# EAGLE design exp30ac (EAGLE 7.7.0)
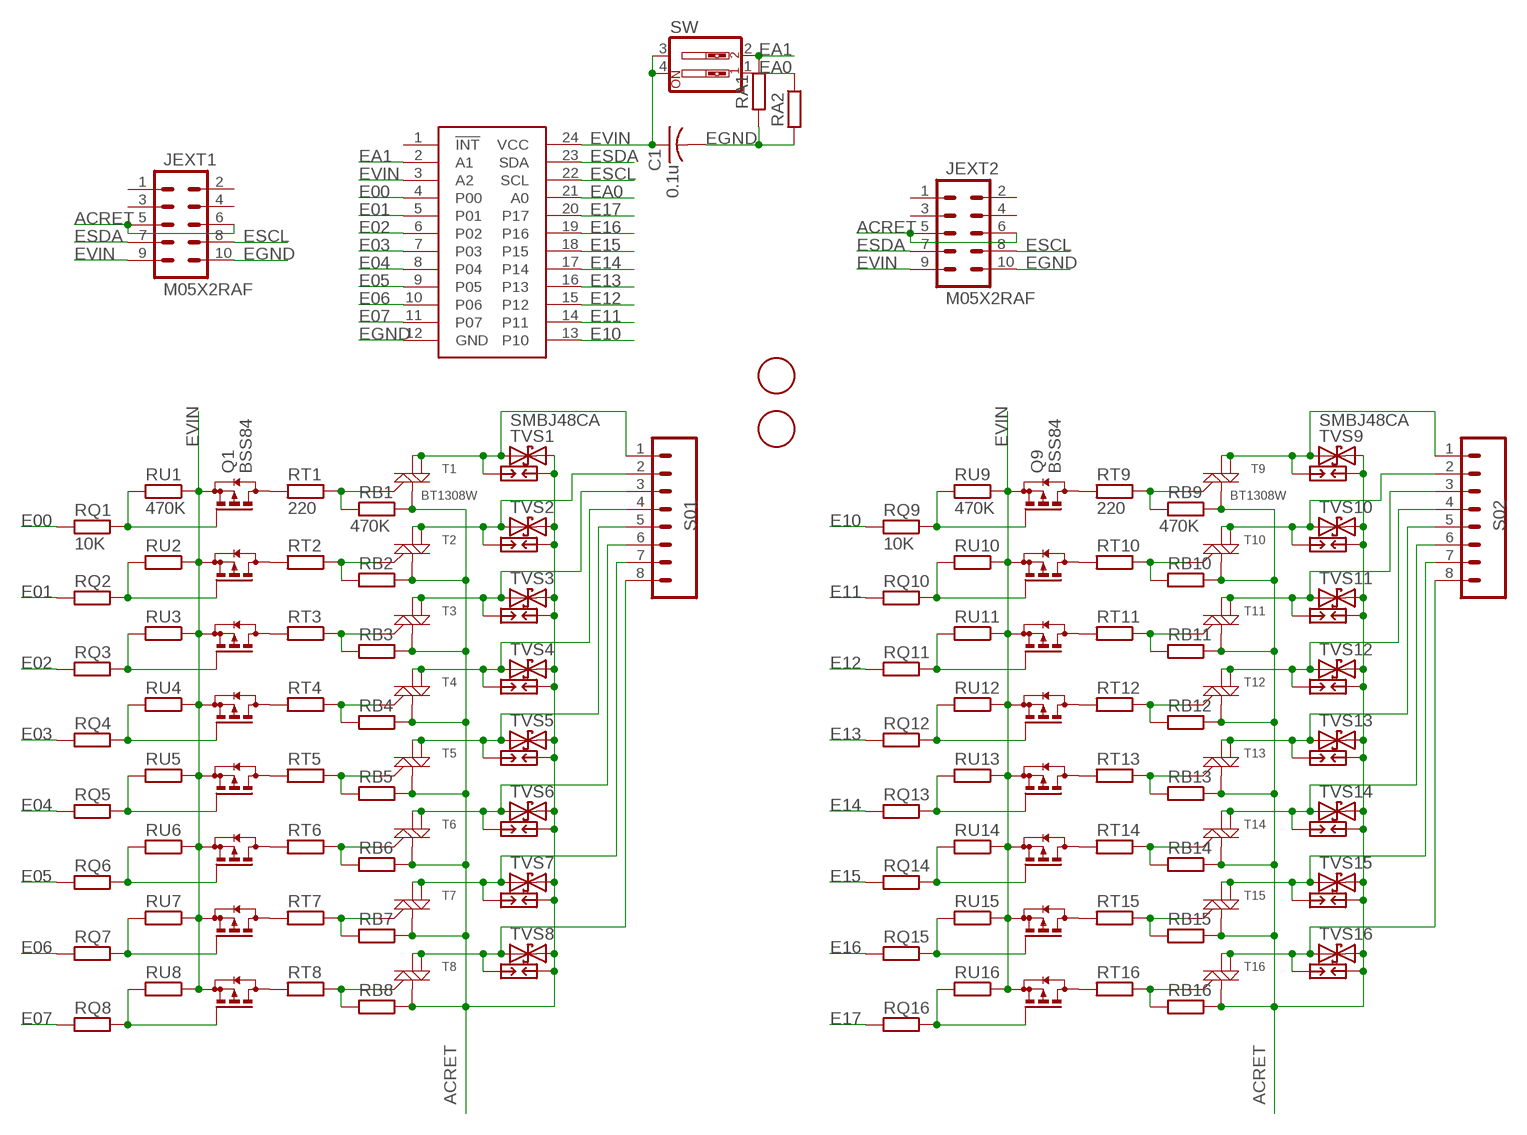
[diagram p0: schematic, sheet 1]

## Parts
C1  0.1u  C-USC0603  [C0603]
JEXT1  M05X2RAF  [2X5-RAF]
JEXT2  M05X2RAF  [2X5-RAF]
PCF8575  PCF8575  [SSOP24]
Q1  BSS84  [SOT23]
Q2  BSS84  [SOT23]
Q3  BSS84  [SOT23]
Q4  BSS84  [SOT23]
Q5  BSS84  [SOT23]
Q6  BSS84  [SOT23]
Q7  BSS84  [SOT23]
Q8  BSS84  [SOT23]
Q9  BSS84  [SOT23]
Q10  BSS84  [SOT23]
Q11  BSS84  [SOT23]
Q12  BSS84  [SOT23]
Q13  BSS84  [SOT23]
Q14  BSS84  [SOT23]
Q15  BSS84  [SOT23]
Q16  BSS84  [SOT23]
RA1  10K  R-EU_R0603  [R0603]
RA2  10K  R-EU_R0603  [R0603]
RB1  470K  R-EU_R0603  [R0603]
RB2  470K  R-EU_R0603  [R0603]
RB3  470K  R-EU_R0603  [R0603]
RB4  470K  R-EU_R0603  [R0603]
RB5  470K  R-EU_R0603  [R0603]
RB6  470K  R-EU_R0603  [R0603]
RB7  470K  R-EU_R0603  [R0603]
RB8  470K  R-EU_R0603  [R0603]
RB9  470K  R-EU_R0603  [R0603]
RB10  470K  R-EU_R0603  [R0603]
RB11  470K  R-EU_R0603  [R0603]
RB12  470K  R-EU_R0603  [R0603]
RB13  470K  R-EU_R0603  [R0603]
RB14  470K  R-EU_R0603  [R0603]
RB15  470K  R-EU_R0603  [R0603]
RB16  470K  R-EU_R0603  [R0603]
RQ1  10K  R-EU_R0603  [R0603]
RQ2  10K  R-EU_R0603  [R0603]
RQ3  10K  R-EU_R0603  [R0603]
RQ4  10K  R-EU_R0603  [R0603]
RQ5  10K  R-EU_R0603  [R0603]
RQ6  10K  R-EU_R0603  [R0603]
RQ7  10K  R-EU_R0603  [R0603]
RQ8  10K  R-EU_R0603  [R0603]
RQ9  10K  R-EU_R0603  [R0603]
RQ10  10K  R-EU_R0603  [R0603]
RQ11  10K  R-EU_R0603  [R0603]
RQ12  10K  R-EU_R0603  [R0603]
RQ13  10K  R-EU_R0603  [R0603]
RQ14  10K  R-EU_R0603  [R0603]
RQ15  10K  R-EU_R0603  [R0603]
RQ16  10K  R-EU_R0603  [R0603]
RT1  220  R-EU_R0603  [R0603]
RT2  220  R-EU_R0603  [R0603]
RT3  220  R-EU_R0603  [R0603]
RT4  220  R-EU_R0603  [R0603]
RT5  220  R-EU_R0603  [R0603]
RT6  220  R-EU_R0603  [R0603]
RT7  220  R-EU_R0603  [R0603]
RT8  220  R-EU_R0603  [R0603]
RT9  220  R-EU_R0603  [R0603]
RT10  220  R-EU_R0603  [R0603]
RT11  220  R-EU_R0603  [R0603]
RT12  220  R-EU_R0603  [R0603]
RT13  220  R-EU_R0603  [R0603]
RT14  220  R-EU_R0603  [R0603]
RT15  220  R-EU_R0603  [R0603]
RT16  220  R-EU_R0603  [R0603]
RU1  470K  R-EU_R0603  [R0603]
RU2  470K  R-EU_R0603  [R0603]
RU3  470K  R-EU_R0603  [R0603]
RU4  470K  R-EU_R0603  [R0603]
RU5  470K  R-EU_R0603  [R0603]
RU6  470K  R-EU_R0603  [R0603]
RU7  470K  R-EU_R0603  [R0603]
RU8  470K  R-EU_R0603  [R0603]
RU9  470K  R-EU_R0603  [R0603]
RU10  470K  R-EU_R0603  [R0603]
RU11  470K  R-EU_R0603  [R0603]
RU12  470K  R-EU_R0603  [R0603]
RU13  470K  R-EU_R0603  [R0603]
RU14  470K  R-EU_R0603  [R0603]
RU15  470K  R-EU_R0603  [R0603]
RU16  470K  R-EU_R0603  [R0603]
S01  M085MM-8  [SCREWTERMINAL-5MM-8]
S02  M085MM-8  [SCREWTERMINAL-5MM-8]
SP1  PCB-SGAP  [PCB-SGAP]
SP2  PCB-SGAP  [PCB-SGAP]
SP3  PCB-SGAP  [PCB-SGAP]
SP4  PCB-SGAP  [PCB-SGAP]
SP5  PCB-SGAP  [PCB-SGAP]
SP6  PCB-SGAP  [PCB-SGAP]
SP7  PCB-SGAP  [PCB-SGAP]
SP8  PCB-SGAP  [PCB-SGAP]
SP9  PCB-SGAP  [PCB-SGAP]
SP10  PCB-SGAP  [PCB-SGAP]
SP11  PCB-SGAP  [PCB-SGAP]
SP12  PCB-SGAP  [PCB-SGAP]
SP13  PCB-SGAP  [PCB-SGAP]
SP14  PCB-SGAP  [PCB-SGAP]
SP15  PCB-SGAP  [PCB-SGAP]
SP16  PCB-SGAP  [PCB-SGAP]
SW  SW_DIP-2  [DIPSWITCH-02]
T1  BT1308W  MAC97SOT223  [SOT223]
T2  MAC97SOT223  [SOT223]
T3  MAC97SOT223  [SOT223]
T4  MAC97SOT223  [SOT223]
T5  MAC97SOT223  [SOT223]
T6  MAC97SOT223  [SOT223]
T7  MAC97SOT223  [SOT223]
T8  MAC97SOT223  [SOT223]
T9  BT1308W  MAC97SOT223  [SOT223]
T10  MAC97SOT223  [SOT223]
T11  MAC97SOT223  [SOT223]
T12  MAC97SOT223  [SOT223]
T13  MAC97SOT223  [SOT223]
T14  MAC97SOT223  [SOT223]
T15  MAC97SOT223  [SOT223]
T16  MAC97SOT223  [SOT223]
TVS1  SMBJ48CA  TVSSMB  [SMB]
TVS2  TVSSMB  [SMB]
TVS3  TVSSMB  [SMB]
TVS4  TVSSMB  [SMB]
TVS5  TVSSMB  [SMB]
TVS6  TVSSMB  [SMB]
TVS7  TVSSMB  [SMB]
TVS8  TVSSMB  [SMB]
TVS9  SMBJ48CA  TVSSMB  [SMB]
TVS10  TVSSMB  [SMB]
TVS11  TVSSMB  [SMB]
TVS12  TVSSMB  [SMB]
TVS13  TVSSMB  [SMB]
TVS14  TVSSMB  [SMB]
TVS15  TVSSMB  [SMB]
TVS16  TVSSMB  [SMB]
U$1  FIDUCIAL  [FIDUCIAL_1MM]
U$2  FIDUCIAL  [FIDUCIAL_1MM]

## Nets
ACRET: JEXT1.5 JEXT1.6 JEXT2.5 JEXT2.6 RB1.1 RB2.1 RB3.1 RB4.1 RB5.1 RB6.1 RB7.1 RB8.1 RB9.1 RB10.1 RB11.1 RB12.1 RB13.1 RB14.1 RB15.1 RB16.1 SP1.1 SP2.1 SP3.1 SP4.1 SP5.1 SP6.1 SP7.1 SP8.1 SP9.1 SP10.1 SP11.1 SP12.1 SP13.1 SP14.1 SP15.1 SP16.1 T1.1(M1) T2.1(M1) T3.1(M1) T4.1(M1) T5.1(M1) T6.1(M1) T7.1(M1) T8.1(M1) T9.1(M1) T10.1(M1) T11.1(M1) T12.1(M1) T13.1(M1) T14.1(M1) T15.1(M1) T16.1(M1) TVS1.C TVS2.C TVS3.C TVS4.C TVS5.C TVS6.C TVS7.C TVS8.C TVS9.C TVS10.C TVS11.C TVS12.C TVS13.C TVS14.C TVS15.C TVS16.C
E00: PCF8575.4(P00) RQ1.2
E01: PCF8575.5(P01) RQ2.2
E02: PCF8575.6(P02) RQ3.2
E03: PCF8575.7(P03) RQ4.2
E04: PCF8575.8(P04) RQ5.2
E05: PCF8575.9(P05) RQ6.2
E06: PCF8575.10(P06) RQ7.2
E07: PCF8575.11(P07) RQ8.2
E10: PCF8575.13(P10) RQ9.2
E11: PCF8575.14(P11) RQ10.2
E12: PCF8575.15(P12) RQ11.2
E13: PCF8575.16(P13) RQ12.2
E14: PCF8575.17(P14) RQ13.2
E15: PCF8575.18(P15) RQ14.2
E16: PCF8575.19(P16) RQ15.2
E17: PCF8575.20(P17) RQ16.2
EA0: PCF8575.21(A0) RA2.1 SW.1
EA1: PCF8575.2(A1) RA1.1 SW.2
EGND [power]: C1.2 JEXT1.10 JEXT2.10 PCF8575.12(GND) RA1.2 RA2.2
ESCL: JEXT1.8 JEXT2.8 PCF8575.22(SCL)
ESDA: JEXT1.7 JEXT2.7 PCF8575.23(SDA)
EVIN [power]: C1.1 JEXT1.9 JEXT2.9 PCF8575.3(A2) PCF8575.24(VCC) Q1.2(S) Q2.2(S) Q3.2(S) Q4.2(S) Q5.2(S) Q6.2(S) Q7.2(S) Q8.2(S) Q9.2(S) Q10.2(S) Q11.2(S) Q12.2(S) Q13.2(S) Q14.2(S) Q15.2(S) Q16.2(S) RU1.1 RU2.1 RU3.1 RU4.1 RU5.1 RU6.1 RU7.1 RU8.1 RU9.1 RU10.1 RU11.1 RU12.1 RU13.1 RU14.1 RU15.1 RU16.1 SW.3 SW.4
N$1: RB9.2 RT9.1 T9.3(G)
N$2: Q1.3(D) RT1.2
N$3: Q2.3(D) RT2.2
N$4: Q3.3(D) RT3.2
N$5: Q4.3(D) RT4.2
N$6: Q5.3(D) RT5.2
N$7: Q6.3(D) RT6.2
N$8: RB1.2 RT1.1 T1.3(G)
N$9: RB2.2 RT2.1 T2.3(G)
N$10: Q7.3(D) RT7.2
N$11: Q8.3(D) RT8.2
N$12: Q1.1(G) RQ1.1 RU1.2
N$13: Q2.1(G) RQ2.1 RU2.2
N$14: Q3.1(G) RQ3.1 RU3.2
N$15: RB3.2 RT3.1 T3.3(G)
N$16: RB4.2 RT4.1 T4.3(G)
N$17: RB10.2 RT10.1 T10.3(G)
N$18: RB5.2 RT5.1 T5.3(G)
N$19: RB6.2 RT6.1 T6.3(G)
N$20: Q4.1(G) RQ4.1 RU4.2
N$21: RB7.2 RT7.1 T7.3(G)
N$22: RB8.2 RT8.1 T8.3(G)
N$23: Q5.1(G) RQ5.1 RU5.2
N$24: RB11.2 RT11.1 T11.3(G)
N$25: Q6.1(G) RQ6.1 RU6.2
N$26: RB12.2 RT12.1 T12.3(G)
N$27: RB13.2 RT13.1 T13.3(G)
N$28: RB14.2 RT14.1 T14.3(G)
N$29: RB15.2 RT15.1 T15.3(G)
N$30: RB16.2 RT16.1 T16.3(G)
N$31: Q7.1(G) RQ7.1 RU7.2
N$32: Q8.1(G) RQ8.1 RU8.2
N$33 [power]: S02.1 SP9.2 T9.2(M2) T9.4(M2-4) TVS9.A
N$34 [power]: S02.2 SP10.2 T10.2(M2) T10.4(M2-4) TVS10.A
N$35 [power]: S02.3 SP11.2 T11.2(M2) T11.4(M2-4) TVS11.A
N$36 [power]: S02.4 SP12.2 T12.2(M2) T12.4(M2-4) TVS12.A
N$37 [power]: S02.5 SP13.2 T13.2(M2) T13.4(M2-4) TVS13.A
N$38 [power]: S02.6 SP14.2 T14.2(M2) T14.4(M2-4) TVS14.A
N$39 [power]: S02.7 SP15.2 T15.2(M2) T15.4(M2-4) TVS15.A
N$40 [power]: S02.8 SP16.2 T16.2(M2) T16.4(M2-4) TVS16.A
N$41: Q9.3(D) RT9.2
N$42: Q10.3(D) RT10.2
N$43: Q11.3(D) RT11.2
N$44: Q12.3(D) RT12.2
N$45: Q13.3(D) RT13.2
N$46: Q14.3(D) RT14.2
N$47: Q15.3(D) RT15.2
N$48: Q16.3(D) RT16.2
N$49: Q9.1(G) RQ9.1 RU9.2
N$50 [power]: S01.1 SP1.2 T1.2(M2) T1.4(M2-4) TVS1.A
N$51 [power]: S01.2 SP2.2 T2.2(M2) T2.4(M2-4) TVS2.A
N$52 [power]: S01.3 SP3.2 T3.2(M2) T3.4(M2-4) TVS3.A
N$53 [power]: S01.4 SP4.2 T4.2(M2) T4.4(M2-4) TVS4.A
N$54 [power]: S01.5 SP5.2 T5.2(M2) T5.4(M2-4) TVS5.A
N$55 [power]: S01.6 SP6.2 T6.2(M2) T6.4(M2-4) TVS6.A
N$56 [power]: S01.7 SP7.2 T7.2(M2) T7.4(M2-4) TVS7.A
N$57 [power]: S01.8 SP8.2 T8.2(M2) T8.4(M2-4) TVS8.A
N$58: Q10.1(G) RQ10.1 RU10.2
N$59: Q11.1(G) RQ11.1 RU11.2
N$60: Q12.1(G) RQ12.1 RU12.2
N$61: Q13.1(G) RQ13.1 RU13.2
N$62: Q14.1(G) RQ14.1 RU14.2
N$63: Q15.1(G) RQ15.1 RU15.2
N$64: Q16.1(G) RQ16.1 RU16.2
Unconnected: JEXT1.1 JEXT1.2 JEXT1.3 JEXT1.4 JEXT2.1 JEXT2.2 JEXT2.3 JEXT2.4 PCF8575.1(!INT)

## Library data of the parts
C1 = adafruit:C-US: CAPACITOR, American symbol
JEXT1 JEXT2 = SparkFunNew:M05X2: Header 5x2 Standard 10-pin dual row 0.1" header. Commonly used with AVR-ISP. Use with Spark Fun Electronics SKU: PRT-00778
PCF8575 = SparkFunNew:PCF8575
Q1-Q16 = transistor-small-signal:BSS84: P-CHANNEL MOS FET
RA1 RA2 RB1-RB16 RQ1-RQ16 RT1-RT16 RU1-RU16 = rcl:R-EU_: RESISTOR, European symbol
S01 S02 = SparkFun:M08: Header 8 Standard 8-pin 0.1" header. Use with straight break away headers (SKU : PRT-00116), right angle break away headers (PRT-00553), swiss pins (PRT-00743), machine pins (PRT-00117), and female headers (PRT-00115).
SP1-SP16 = varistor:PCB-SGAP
SW = SparkFun:SW_DIP-2: DIP SWITCH
T1-T16 = SparkFun:MAC97: MAC97 Triac http://www.onsemi.com/pub_link/Collateral/MAC97-D.PDF
TVS1-TVS16 = SparkFunNew:TVS
U$1 U$2 = adafruitGood:FIDUCIAL: For use by pick and place machines to calibrate the vision/machine, 1mm By microbuilder.eu

## Net classes
0 default: width 0.203 mm, clearance 0.178 mm
1 power: width 0.254 mm, clearance 0.203 mm
2 relaypower: width 0.813 mm, clearance 0.203 mm

## Board
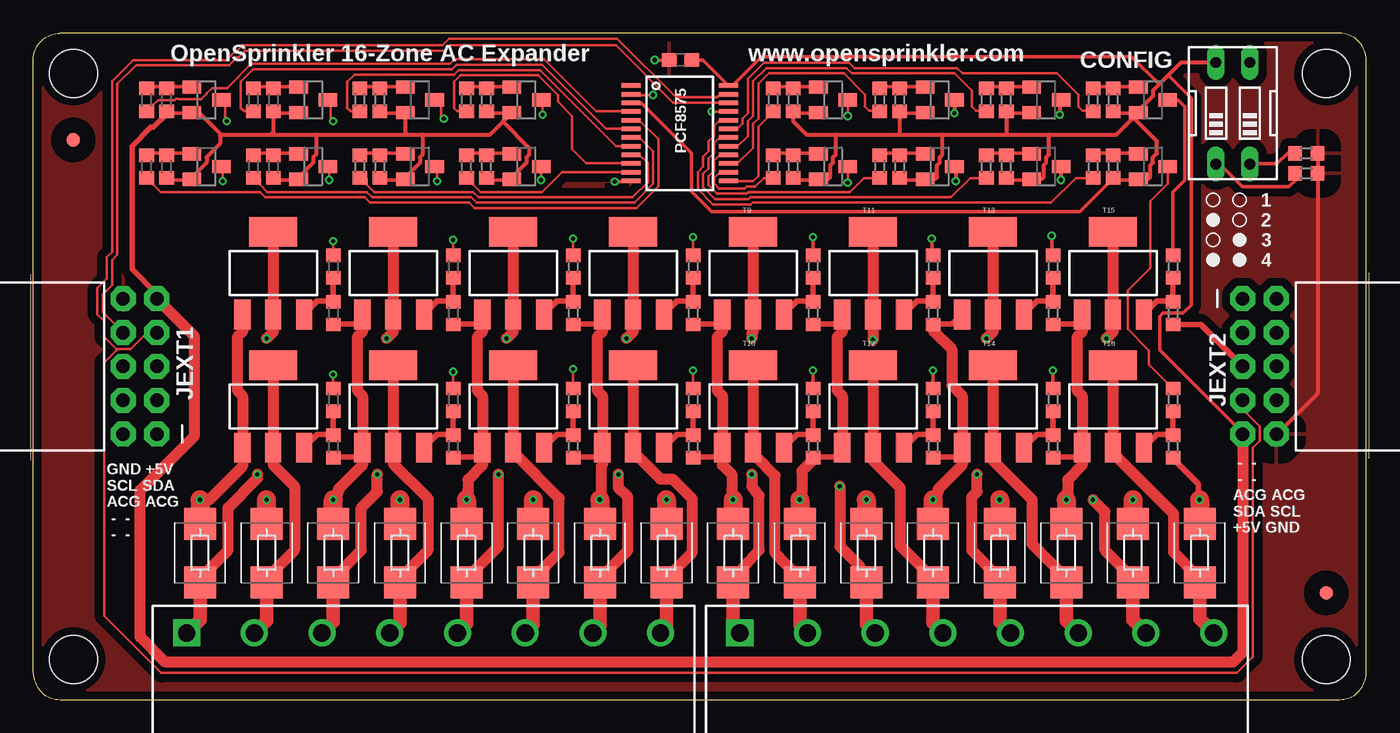
[diagram p1: board, top side]
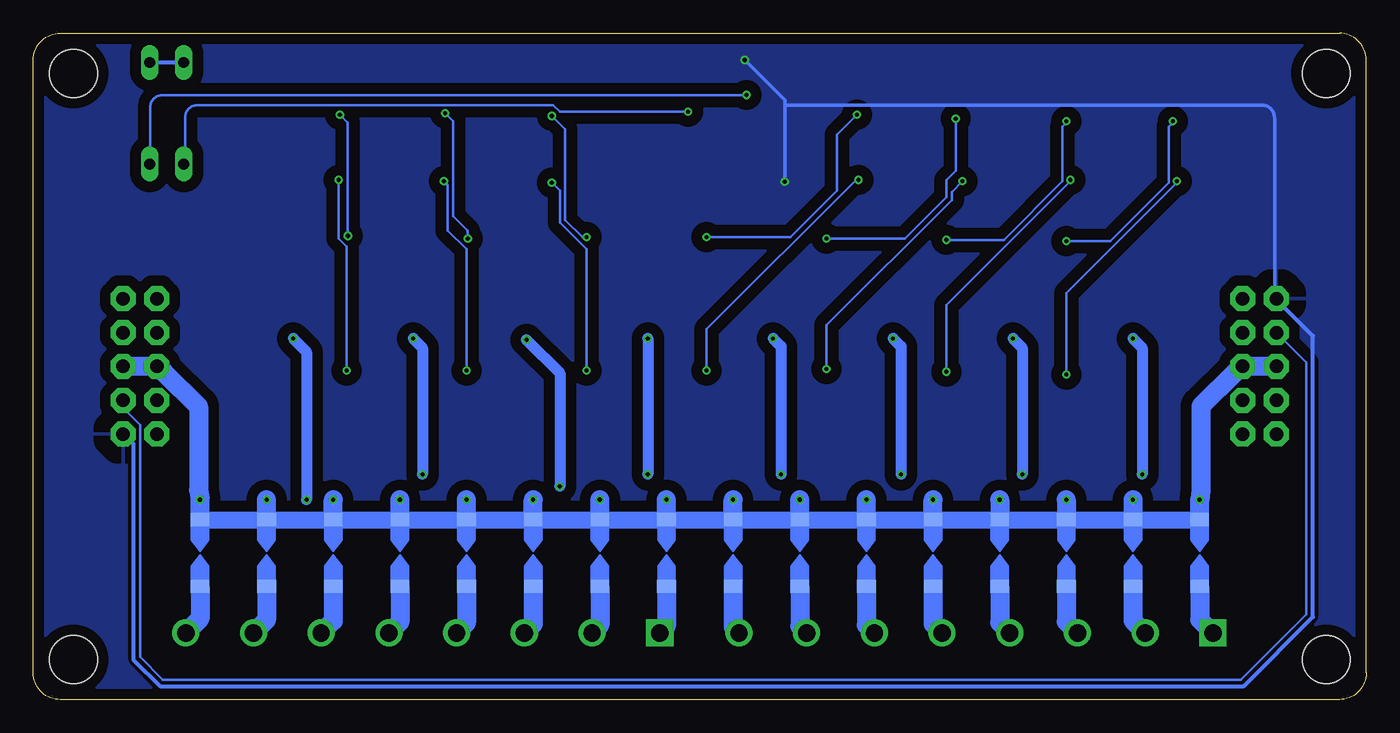
[diagram p2: board, bottom side, seen from below]

Size 100 x 50 mm. Coordinates in mm from the lower left corner, seen from the top.
Outline: 2,0 98,0 arc90 100,2 100,48 arc90 98,50 2,50 arc90 0,48 0,2 arc90 2,0
Copper layers (1*16): Top 0.035mm / dielectric 1.5mm / Bottom 0.035mm
Design rules "Fusion_eagle_rule_v1.1 *": minimum track width 6mil, minimum drill 12mil, track to track 6mil, track to pad 6mil, pad to pad 6mil, via to via 6mil, smd to smd 0mil, copper to edge 10mil, drill to drill 10mil, minimum pad ring 10mil, minimum via ring 6mil, stop-mask expansion 2mil, vias tented up to drill 100mil, thermal gap 50mil
Holes 3.6 mm at 3,3 97,3 3,47 97,47

### Footprints (pad centres in the part's own frame; a part is rotated, then mirrored left to right if it is on the bottom)
C0603 = smd 1.1 x 1: 1 -0.85,0; 2 0.85,0
2X5-RAF = drill 1.016 pad 1.88 octagon: 1 -1.27,5.08; 2 1.27,5.08; 3 -1.27,2.54; 4 1.27,2.54; 5 -1.27,0; 6 1.27,0; 7 -1.27,-2.54; 8 1.27,-2.54; 9 -1.27,-5.08; 10 1.27,-5.08
SSOP24 = smd 0.348 x 1.397: 1 -3.575,-3.656; 2 -2.925,-3.656; 3 -2.275,-3.656; 4 -1.625,-3.656; 5 -0.975,-3.656; 6 -0.325,-3.656; 7 0.325,-3.656; 8 0.975,-3.656; 9 1.625,-3.656; 10 2.275,-3.656; 11 2.925,-3.656; 12 3.575,-3.656; 13 3.575,3.656; 14 2.925,3.656; 15 2.275,3.656; 16 1.625,3.656; 17 0.975,3.656; 18 0.325,3.656; 19 -0.325,3.656; 20 -0.975,3.656; 21 -1.625,3.656; 22 -2.275,3.656; 23 -2.925,3.656; 24 -3.575,3.656
SOT23 = smd 1 x 1.4: 1 -0.95,-1.1; 2 0.95,-1.1; 3 0,1.1
R0603 = smd 1 x 1.1: 1 -0.85,0; 2 0.85,0
SCREWTERMINAL-5MM-8 = drill 1.3 pad 2.032 square: 1 0,0 | drill 1.3 pad 2.032: 2 5.08,0; 3 10.16,0; 4 15.24,0; 5 20.32,0; 6 25.4,0; 7 30.48,0; 8 35.56,0
PCB-SGAP = smd 1 x 1.4 bottom: 1 -2.5,0; 2 2.5,0
DIPSWITCH-02 = drill 0.813 long: 1 -1.27,-3.81; 2 1.27,-3.81; 3 1.27,3.81; 4 -1.27,3.81
SOT223 = smd 1.219 x 2.235: 1 -2.311,-3.099; 2 0,-3.099; 3 2.311,-3.099 | smd 3.6 x 2.2: 4 0,3.099
SMB = smd 2.4 x 2.4: A 2.2,0; C -2.2,0
FIDUCIAL_1MM = smd 1 x 1: 1 0,0

### Placement (x,y rotation side)
C1  48.55,48 180 top
JEXT1  8,25 180 top
JEXT2  92,25 0 top
PCF8575  48.5,42.5 270 top
Q1  13,45 270 top
Q2  13,40 270 top
Q3  21,45 270 top
Q4  21,40 270 top
Q5  29,45 270 top
Q6  29,40 270 top
Q7  37,45 270 top
Q8  37,40 270 top
Q9  60,45 270 top
Q10  60,40 270 top
Q11  68,45 270 top
Q12  68,40 270 top
Q13  76,45 270 top
Q14  76,40 270 top
Q15  84,45 270 top
Q16  84,40 270 top
RA1  95.5,41 0 top
RA2  95.5,39.5 0 top
RB1  22.5,29 90 top
RB2  22.5,19 90 top
RB3  31.5,29 90 top
RB4  31.5,19 90 top
RB5  40.5,29 90 top
RB6  40.5,19 90 top
RB7  49.5,29 90 top
RB8  49.5,19 90 top
RB9  58.5,29 90 top
RB10  58.5,19 90 top
RB11  67.5,29 90 top
RB12  67.5,19 90 top
RB13  76.5,29 90 top
RB14  76.5,19 90 top
RB15  85.5,29 90 top
RB16  85.5,19 90 top
RQ1  8.5,45 270 top
RQ2  8.5,40 270 top
RQ3  16.5,45 270 top
RQ4  16.5,40 270 top
RQ5  24.5,45 270 top
RQ6  24.5,40 270 top
RQ7  32.5,45 270 top
RQ8  32.5,40 270 top
RQ9  55.5,45 270 top
RQ10  55.5,40 270 top
RQ11  63.5,45 270 top
RQ12  63.5,40 270 top
RQ13  71.5,45 270 top
RQ14  71.5,40 270 top
RQ15  79.5,45 270 top
RQ16  79.5,40 270 top
RT1  22.5,32.5 90 top
RT2  22.5,22.5 90 top
RT3  31.5,32.5 90 top
RT4  31.5,22.5 90 top
RT5  40.5,32.5 90 top
RT6  40.5,22.5 90 top
RT7  49.5,32.5 90 top
RT8  49.5,22.5 90 top
RT9  58.5,32.5 90 top
RT10  58.5,22.5 90 top
RT11  67.5,32.5 90 top
RT12  67.5,22.5 90 top
RT13  76.5,32.5 90 top
RT14  76.5,22.5 90 top
RT15  85.5,32.5 90 top
RT16  85.5,22.5 90 top
RU1  10,45 90 top
RU2  10,40 90 top
RU3  18,45 90 top
RU4  18,40 90 top
RU5  26,45 90 top
RU6  26,40 90 top
RU7  34,45 90 top
RU8  34,40 90 top
RU9  57,45 90 top
RU10  57,40 90 top
RU11  65,45 90 top
RU12  65,40 90 top
RU13  73,45 90 top
RU14  73,40 90 top
RU15  81,45 90 top
RU16  81,40 90 top
S01  11.5,5 0 top
S02  53,5 0 top
SP1  12.5,11 270 top
SP2  17.5,11 270 top
SP3  22.5,11 270 top
SP4  27.5,11 270 top
SP5  32.5,11 270 top
SP6  37.5,11 270 top
SP7  42.5,11 270 top
SP8  47.5,11 270 top
SP9  52.5,11 270 top
SP10  57.5,11 270 top
SP11  62.5,11 270 top
SP12  67.5,11 270 top
SP13  72.5,11 270 top
SP14  77.5,11 270 top
SP15  82.5,11 270 top
SP16  87.5,11 270 top
SW  90,44 0 top
T1  18,32 0 top
T2  18,22 0 top
T3  27,32 0 top
T4  27,22 0 top
T5  36,32 0 top
T6  36,22 0 top
T7  45,32 0 top
T8  45,22 0 top
T9  54,32 0 top
T10  54,22 0 top
T11  63,32 0 top
T12  63,22 0 top
T13  72,32 0 top
T14  72,22 0 top
T15  81,32 0 top
T16  81,22 0 top
TVS1  12.5,11 270 top
TVS2  17.5,11 270 top
TVS3  22.5,11 270 top
TVS4  27.5,11 270 top
TVS5  32.5,11 270 top
TVS6  37.5,11 270 top
TVS7  42.5,11 270 top
TVS8  47.5,11 270 top
TVS9  52.5,11 270 top
TVS10  57.5,11 270 top
TVS11  62.5,11 270 top
TVS12  67.5,11 270 top
TVS13  72.5,11 270 top
TVS14  77.5,11 270 top
TVS15  82.5,11 270 top
TVS16  87.5,11 270 top
U$1  3,42 0 top
U$2  97,8 0 top

### Tracks (layer width: path | path; a pad name or v marks a point on that pad's centre or on a via)
ACRET  (via drill 0.3)
  Top 0.406: T3.1 24.3,28.2 22.5,28.2 RB1.1 | T4.1 24.3,18.2 22.5,18.2 RB2.1 | T5.1 33.3,28.2 31.5,28.2 RB3.1 | T6.1 33.3,18.2 31.5,18.2 RB4.1 | T7.1 42.3,28.2 40.5,28.2 RB5.1 | T8.1 42.3,18.2 40.5,18.2 RB6.1 | T9.1 51.3,28.2 49.5,28.2 RB7.1 | T10.1 51.3,18.2 49.5,18.2 RB8.1 | T11.1 60.3,28.2 58.5,28.2 RB9.1 | T12.1 60.3,18.2 58.5,18.2 RB10.1 | T13.1 69.6,28.9 68.9,28.2 67.9,28.2 RB11.1 | T14.1 69.3,18.2 67.5,18.2 RB12.1 | T15.1 78.3,28.2 76.5,28.2 RB13.1 | T16.1 78.3,18.2 76.5,18.2 RB14.1 | v87.5,15 87.4,15.7 87.4,16.2 85.5,18.1 RB16.1 | RB15.1 87.58,28.15 JEXT2.5
  Top 0.813: T1.1 15.7,27.6 15.3,27.2 15.3,23.2 15.7,22.8 15.7,19 T2.1 15.7,18.5 15.7,17.5 13.2,15 v12.5,15 | T3.1 24.7,27.6 24.3,27.2 24.3,23.2 24.7,22.8 24.7,19 T4.1 24.7,18.5 24.7,17.6 22.9,15.8 22.9,15.6 v22.5,15 | T5.1 33.7,27.6 33.3,27.2 33.3,23.2 33.7,22.8 33.7,19 T6.1 33.7,18.5 33.7,17.6 32.6,16.5 32.6,15.7 v32.5,15 | T7.1 42.7,27.6 42.3,27.2 42.3,23.2 42.7,22.8 42.7,19 T8.1 42.7,18.5 42.7,17.6 42.6,17.5 42.6,15.7 v42.5,15 | T9.1 51.7,27.6 51.3,27.2 51.3,23.2 51.7,22.8 51.7,19 T10.1 51.7,18.5 51.7,17.6 52.4,16.9 52.4,15.7 v52.5,15 | T12.1 60.7,19 60.7,22.8 60.3,23.2 60.3,27.2 60.7,27.6 T11.1 | RB11.1 67.5,27.7 68.9,26.3 68.9,23.6 69.7,22.8 69.7,19 T14.1 69.7,18.5 69.7,17.6 67.9,15.8 67.9,15.6 v67.5,15 | T15.1 78.7,27.6 78.3,27.2 78.3,23.2 78.7,22.8 78.7,19 T16.1 78.7,18.5 78.7,17.6 77.6,16.5 77.6,15.7 v77.5,15 | v57.5,15 57.65,15.7 57.65,17.15 58.45,17.95 RB10.1
  Top 1.422: v12.5,15 TVS1.C | TVS2.C v17.5,15 | TVS3.C v22.5,15 | TVS4.C v27.5,15 | v32.5,15 TVS5.C | v37.5,15 TVS6.C | v42.5,15 TVS7.C | v47.5,15 TVS8.C | v52.5,15 TVS9.C | v57.5,15 TVS10.C | v67.5,15 TVS12.C | v72.5,15 TVS13.C | v77.5,15 TVS14.C | v82.5,15 TVS15.C | v87.5,15 TVS16.C | v62.5,15 TVS11.C
  Bottom 1.27: SP1.1 SP2.1 SP3.1 SP4.1 SP5.1 SP6.1 SP7.1 SP8.1 SP9.1 SP10.1 SP11.1 SP12.1 SP13.1 SP14.1 SP15.1 SP16.1
  Bottom 1.422: SP1.1 v12.5,15 12.4,15.7 12.4,22 9.8,24.6 JEXT1.5 JEXT1.6 | v17.5,15 SP2.1 | v22.5,15 SP3.1 22.5,13 | v27.5,15 SP4.1 | SP5.1 v32.5,15 | SP6.1 v37.5,15 | SP7.1 v42.5,15 | SP8.1 v47.5,15 | SP9.1 v52.5,15 | SP10.1 v57.5,15 | SP12.1 v67.5,15 | SP13.1 v72.5,15 | SP14.1 v77.5,15 | SP15.1 v82.5,15 | SP16.1 v87.5,15 87.6,15.7 87.6,22 90.2,24.6 JEXT2.5 JEXT2.6 | SP11.1 v62.5,15
E00
  Top 0.203: RQ1.2 8.95,44.15 9,44.2 9,44.65 9.35,45 10.6,45 10.7,45.1 10.8,45.1 10.85,45.05 12.6,45.05 13,45.45 13,45.5 13.4,45.9 14.55,45.9 16.35,47.7 31.25,47.7 31.6,48.05 38.3,48.05 42.2,44.15 44.8,44.15 PCF8575.4
E01
  Top 0.203: RQ2.2 8.95,39.15 9,39.1 9,38.65 9.55,38.1 17,38.1 17.4,37.7 24.85,37.7 25.25,37.3 32.7,37.3 33.1,36.9 45.25,36.9 46.9,38.55 46.9,42.05 45.45,43.5 44.85,43.5 PCF8575.5
E02
  Top 0.203: RQ3.2 15.8,44.15 15.55,44.4 15.55,46.35 16.5,47.3 31.4,47.3 31.75,47.65 38.15,47.65 42.95,42.85 44.8,42.85 PCF8575.6
E03
  Top 0.203: RQ4.2 16.95,39.15 17,39.1 17,38.65 17.55,38.1 25,38.1 25.4,37.7 32.85,37.7 33.25,37.3 45.1,37.3 46.5,38.7 46.5,41.15 45.45,42.2 44.85,42.2 PCF8575.7
E04
  Top 0.203: RQ5.2 23.8,44.15 23.55,44.4 23.55,46.35 24.1,46.9 31.55,46.9 31.9,47.25 38,47.25 43.7,41.55 44.8,41.55 PCF8575.8
E05
  Top 0.203: RQ6.2 24.95,39.15 25,39.1 25,38.65 25.55,38.1 33,38.1 33.4,37.7 44.95,37.7 46.1,38.85 46.1,40.25 45.45,40.9 44.85,40.9 PCF8575.9
E06
  Top 0.203: RQ7.2 31.8,44.15 31.55,44.4 31.55,46.35 32.05,46.85 37.85,46.85 39.35,45.35 39.35,44.85 40.4,43.8 40.4,41.3 41.45,40.25 44.8,40.25 PCF8575.10
E07
  Top 0.203: RQ8.2 32.95,39.15 33,39.1 33,38.65 33.55,38.1 38.15,38.1 39.65,39.6 44.8,39.6 PCF8575.11
E10
  Top 0.203: RQ9.2 55.5,44.1 54.4,43 54.4,39.3 54,38.9 52.2,38.9 PCF8575.13
E11
  Top 0.203: PCF8575.14 52.15,39.6 51.5,39.6 51.05,39.15 51.05,38.75 51.45,38.35 53.35,38.35 53.5,38.5 54.15,38.5 54.8,39.15 RQ10.2
E12
  Top 0.203: RQ11.2 63.5,44.2 62.7,44.2 62.4,44.5 62.4,45.4 60.8,47 55.2,47 54.4,46.2 54.4,43.6 54,43.2 54,41.4 52.8,40.2 52.2,40.2 PCF8575.15
E13
  Top 0.203: PCF8575.16 52.15,40.9 51.5,40.9 51.05,40.45 51.05,39.7 50.65,39.3 50.65,38.6 51.3,37.95 53.5,37.95 53.65,38.1 61.25,38.1 62.3,39.15 RQ12.2
E14
  Top 0.203: RQ13.2 71.5,44.2 70.7,44.2 70.4,44.5 70.4,45.7 69.1,47 61.4,47 61,47.4 55,47.4 54,46.4 54,43.8 53.6,43.4 53.6,42.3 52.8,41.5 52.2,41.5 PCF8575.17
E15
  Top 0.203: PCF8575.18 52.15,42.2 51.5,42.2 51.05,41.75 51.05,41 50.65,40.6 50.65,39.85 50.25,39.45 50.25,38.45 51.15,37.55 53.65,37.55 53.8,37.7 68.85,37.7 70.3,39.15 RQ14.2
E16
  Top 0.203: RQ15.2 79.5,44.2 78.7,44.2 78.4,44.5 78.4,45.4 76.8,47 69.7,47 69.3,47.4 61.6,47.4 61.2,47.8 54.8,47.8 53.6,46.6 53.6,44 53.2,43.6 53.2,43.2 52.8,42.8 52.2,42.8 PCF8575.19
E17
  Top 0.203: PCF8575.20 52.15,43.5 51.5,43.5 51.05,43.05 51.05,42.3 50.65,41.9 50.65,41.15 50.25,40.75 50.25,40 49.85,39.6 49.85,38.3 51,37.15 53.8,37.15 53.95,37.3 76.35,37.3 78.2,39.15 RQ16.2
EA0  (via drill 0.3)
  Top 0.203: v50.88,44.12 PCF8575.21
  Top 0.254: SW.1 88.8,40.1 89.1,40.1 90.7,38.5 94.2,38.5 94.7,39 94.7,39.5 RA2.1
  Bottom 0.203: v50.88,44.12 60.5,44.12 61,44.62 87.62,44.62 arc-90 88.62,43.62 88.62,40.25 SW.1
EA1  (via drill 0.3)
  Top 0.203: v46.5,45.38 44.88,45.38 PCF8575.2
  Top 0.254: RA1.1 94.1,41 93.3,40.2 91.3,40.2 SW.2
  Bottom 0.203: v46.5,45.38 90.25,45.38 arc-90 91.25,44.38 91.25,40.25 SW.2
EGND  (via drill 0.3)
  Top 0.254: v46.62,48 C1.2 | v43.62,38.88 44.75,38.88 PCF8575.12
  Top 0.305: RA1.2 RA2.2 96.35,23 96.3,22.9 93.3,19.9 JEXT2.10
  Bottom 0.254: v46.62,48 43.62,45 43.62,44.62 | v43.62,38.88 43.62,44.62 | 43.62,44.62 7.88,44.62 arc90 6.88,43.62 6.88,30.12 JEXT1.10
  Bottom 0.305: JEXT2.10 93.2,19.9 92.5,19.2 92.5,3 90.5,1 9.2,1 4,6.2 4,27.3 6.7,30 JEXT1.10
  pour Top (isolate 0.61): 0,50 100,50 100,0 0,0
  pour Bottom (isolate 0.813): 0,50 100,50 100,0 0,0
ESCL
  Top 0.203: JEXT1.8 6.7,27.6 5.2,29.1 5.2,30.4 5.9,31.1 5.9,33 6.3,33.4 6.3,46.2 7.7,47.6 14.7,47.6 15.3,48.2 15.4,48.2 15.9,48.7 30.9,48.7 31.3,49.1 43.7,49.1 48,44.8 52.1,44.8 PCF8575.22
  Bottom 0.203: JEXT2.8 93.27,21.87 92,20.6 92,3.2 90.3,1.5 9.4,1.5 4.5,6.4 4.5,25.31 JEXT1.8
ESDA
  Top 0.203: JEXT1.7 9.2,27.5 8.5,27.5 7.3,26.3 6.2,26.3 | 6.2,26.3 5.3,27.2 5.3,28.4 4.8,28.9 4.8,30.9 5.5,31.6 5.5,33.2 5.9,33.6 5.9,46.4 7.5,48 14.5,48 15.1,48.6 15.2,48.6 15.7,49.1 30.7,49.1 31.2,49.6 43.8,49.6 48.2,45.2 51.3,45.2 51.5,45.4 52.1,45.4 PCF8575.23 | JEXT2.7 90.8,22.4 90.8,21.7 92,20.5 92,19.4 91.5,18.9 91.5,3.2 90.3,2 9.6,2 5.3,6.3 5.3,25.3 6.2,26.2 6.2,26.3
EVIN
  Top 0.254: Q1.2 11.5,44 10,44 RU1.1 | Q3.2 19.5,44 18,44 RU3.1 | Q2.2 11.5,39 10,39 RU2.1 | Q4.2 19.5,39 18,39 RU4.1 | Q5.2 27.5,44 26,44 RU5.1 | Q6.2 27.5,39 26,39 RU6.1 | Q7.2 35.5,44 34,44 RU7.1 | Q8.2 35.5,39 34,39 RU8.1 | Q9.2 58.5,44 57,44 RU9.1 | Q10.2 58.5,39 57,39 RU10.1 | Q11.2 66.5,44 65,44 RU11.1 | Q12.2 66.5,39 65,39 RU12.1 | Q13.2 74.5,44 73,44 RU13.1 | Q14.2 74.5,39 73,39 RU14.1 | Q15.2 82.5,44 81,44 RU15.1 | Q16.2 82.5,39 81,39 RU16.1 80.88,39 78.5,36.62 50.88,36.62 49.38,38.12 49.38,41 45.62,44.75 44.88,44.75 PCF8575.3 | C1.1 50.25,48 52.12,46.12 PCF8575.24 52.25,46.12 52.5,46.12 54.62,48.25 82.38,48.25 84.46,46.16 | 85.15,46.85 86.88,45.12 86.88,29.62 86.25,29 84.75,29 84.5,28.75 84.5,26.25 90.5,20.25 JEXT2.9
  Top 0.305: Q1.2 12.45,44.05 14.1,42.4 | 14.1,42.4 17.8,42.4 | 17.8,42.4 21.2,42.4 | 21.2,42.4 28.1,42.4 | 28.1,42.4 29.2,42.4 | 29.2,42.4 34.25,42.4 35.23,43.38 | 35.23,43.38 Q7.2 | 18,44 18,42.6 17.8,42.4 | Q5.2 27.9,42.6 28.1,42.4 | Q2.2 12,39.1 12,39.3 13,40.3 13,40.7 14,41.7 14,42.3 14.1,42.4 | 21.2,42.4 21.2,40.9 21,40.7 21,40.3 20,39.3 20,39.1 Q4.2 | 29.2,42.4 29.2,40.9 29,40.7 29,40.3 28,39.3 28,39.1 Q6.2 | 35.23,43.38 37.2,41.4 37.2,40.9 37,40.7 37,40.3 36,39.3 36,39.1 Q8.2 | 57,44 57,43.4 58,42.4 60.2,42.4 | 60.2,42.4 65,42.4 | 65,42.4 68.2,42.4 | 68.2,42.4 73,42.4 | 73,42.4 76.2,42.4 | 76.2,42.4 81.25,42.4 Q15.2 | 60.2,42.4 60.2,40.9 60,40.7 60,40.3 59.8,40.1 59.8,39.2 59.7,39.1 59,39.1 Q10.2 | 68.2,42.4 68.2,40.9 68,40.7 68,40.3 67.8,40.1 67.8,39.2 67.7,39.1 67,39.1 Q12.2 | 76.2,42.4 76.2,40.9 76,40.7 76,40.3 75.8,40.1 75.8,39.2 75.7,39.1 75,39.1 Q14.2 | Q16.2 83,39.1 83.7,39.1 83.8,39.2 83.8,40.1 84,40.3 84,40.7 84.3,41 84.3,41.9 82.6,43.6 Q15.2 | 65,42.4 RU11.1 | RU13.1 73,42.4 | SW.4 88.7,47.8 86.1,47.8 85.15,46.85 84.46,46.16 84,45.7 84,45.3 82.9,44.2 Q15.2
  Top 0.406: RU1.1 9.95,43.9 9,42.95 8.8,42.95 7.4,41.55 7.4,32.3 9.27,30.43 JEXT1.9
  Top 0.813: JEXT2.9 90.73,3.53 90,2.8 9.9,2.8 8,4.7 8,15.7 12.1,19.8 12.1,27.25 JEXT1.9
  Bottom 0.305: SW.3 91.2,47.8 88.8,47.8 SW.4
N$1
  Top 0.406: RT9.1 RB9.2 58.3,29.9 57.3,29.9 56.4,29 T9.3
N$2  (via drill 0.3)
  Top 0.203: Q1.3 14.3,45 14.4,44.9 14.4,43.4 v14.5,43.4 | v22.5,34.4 22.5,33.5 22.4,33.4 22.5,33.3 RT1.2
  Bottom 0.203: 14.4,43.5 v14.5,43.4 14.5,43.3 14.8,43 14.8,38.8 19.2,34.4 v22.5,34.4
N$3  (via drill 0.3)
  Top 0.203: v14.2,38.9 14.2,40 Q2.3 | v22.5,24.4 22.5,23.5 22.4,23.4 22.5,23.3 RT2.2
  Bottom 0.203: v22.5,24.4 22.5,30.5 14.2,38.8 v14.2,38.9
N$4  (via drill 0.3)
  Top 0.203: Q3.3 22.2,45 22.3,44.9 22.3,43.5 22.4,43.5 v22.5,43.4 | v31.5,34.5 31.5,33.5 31.4,33.4 31.5,33.3 RT3.2
  Bottom 0.203: 22.3,43.5 22.4,43.5 v22.5,43.4 22.5,43.3 22.8,43 22.8,38.9 27.2,34.5 v31.5,34.5
N$5  (via drill 0.3)
  Top 0.203: v22.2,39 22.2,40 Q4.3 | v31.5,24.6 31.5,23.5 31.4,23.4 31.5,23.3 RT4.2
  Bottom 0.203: v31.5,24.6 31.5,29.6 22.2,38.9 v22.2,39
N$6  (via drill 0.3)
  Top 0.203: Q5.3 30.5,45 30.6,44.9 30.6,43.7 30.7,43.7 v30.8,43.6 | v40.5,34.6 40.5,33.5 40.4,33.4 40.5,33.3 RT5.2
  Bottom 0.203: 30.6,43.7 30.7,43.7 v30.8,43.6 30.8,39.7 31.5,39 31.5,37.7 34.6,34.6 v40.5,34.6
N$7  (via drill 0.3)
  Top 0.203: v30.3,38.9 30.3,39.9 30.2,40 Q6.3 | v40.5,24.8 40.5,23.5 40.4,23.4 40.5,23.3 RT6.2
  Bottom 0.203: v40.5,24.8 40.5,28.1 31.1,37.5 31.1,38.1 v30.3,38.9
N$8
  Top 0.406: RT1.1 RB1.2 22.3,29.9 21.3,29.9 20.4,29 T1.3
N$9
  Top 0.406: RT2.1 RB2.2 22.3,19.9 21.3,19.9 20.4,19 T2.3
N$10  (via drill 0.3)
  Top 0.203: v38.2,43.9 38.2,45 Q7.3 | v49.5,34.7 49.5,33.5 49.4,33.4 49.5,33.3 RT7.2
  Bottom 0.203: v38.2,43.9 39.7,42.4 39.7,38.2 43.2,34.7 v49.5,34.7
N$11  (via drill 0.3)
  Top 0.203: Q8.3 v38.1,39 | v49.5,24.7 49.5,23.5 49.4,23.4 49.5,23.3 RT8.2
  Bottom 0.203: v49.5,24.7 49.5,27.8 38.3,39 v38.1,39
N$12
  Top 0.254: 10,46 8.5,46 RQ1.1 | 10,46 11.5,46 Q1.1 | 10,46 RU1.2
N$13
  Top 0.254: 10,41 8.5,41 RQ2.1 | 10,41 11.5,41 Q2.1 | 10,41 RU2.2
N$14
  Top 0.254: 18,46 16.5,46 RQ3.1 | 18,46 19.5,46 Q3.1 | 18,46 RU3.2
N$15
  Top 0.406: RT3.1 RB3.2 31.3,29.9 30.3,29.9 29.4,29 T3.3
N$16
  Top 0.406: RT4.1 RB4.2 31.3,19.9 30.3,19.9 29.4,19 T4.3
N$17
  Top 0.406: RT10.1 RB10.2 58.3,19.9 57.3,19.9 56.4,19 T10.3
N$18
  Top 0.406: RT5.1 RB5.2 40.3,29.9 39.3,29.9 38.4,29 T5.3
N$19
  Top 0.406: RT6.1 RB6.2 40.3,19.9 39.3,19.9 38.4,19 T6.3
N$20
  Top 0.254: 18,41 16.5,41 RQ4.1 | 18,41 19.5,41 Q4.1 | 18,41 RU4.2
N$21
  Top 0.406: RT7.1 RB7.2 49.3,29.9 48.3,29.9 47.4,29 T7.3
N$22
  Top 0.406: RT8.1 RB8.2 49.3,19.9 48.3,19.9 47.4,19 T8.3
N$23
  Top 0.254: 26,46 24.5,46 RQ5.1 | 26,46 27.5,46 Q5.1 | 26,46 RU5.2
N$24
  Top 0.406: RT11.1 RB11.2 67.3,29.9 66.3,29.9 65.4,29 T11.3
N$25
  Top 0.254: 26,41 24.5,41 RQ6.1 | 26,41 27.5,41 Q6.1 | 26,41 RU6.2
N$26
  Top 0.406: RT12.1 RB12.2 67.3,19.9 66.3,19.9 65.4,19 T12.3
N$27
  Top 0.406: RT13.1 RB13.2 76.3,29.9 75.3,29.9 74.4,29 T13.3
N$28
  Top 0.406: RT14.1 RB14.2 76.3,19.9 75.3,19.9 74.4,19 T14.3
N$29
  Top 0.406: RT15.1 RB15.2 85.3,29.9 84.3,29.9 83.4,29 T15.3
N$30
  Top 0.406: RT16.1 RB16.2 85.3,19.9 84.3,19.9 83.4,19 T16.3
N$31
  Top 0.254: 34,46 32.5,46 RQ7.1 | 34,46 35.5,46 Q7.1 | 34,46 RU7.2
N$32
  Top 0.254: 34,41 32.5,41 RQ8.1 | 34,41 35.5,41 Q8.1 | 34,41 RU8.2
N$33  (via drill 0.3)
  Top 0.813: T9.4 T9.2 54,27.6 53.9,27.5 v53.9,27.1 | v53.9,16.9 53.9,16 54.45,15.3 54.45,11.2 52.7,9.3 TVS9.A
  Top 1.016: TVS9.A 52.5,5.5 S02.1
  Bottom 0.813: v53.9,27.1 v53.9,16.9
  Bottom 1.422: SP9.2 52.5,5.5 S02.1
N$34
  Top 0.813: T10.4 T10.2 54,18.3 54.05,18.25 54.2,18.25 55.65,16.8 55.65,11 57.3,9.3 TVS10.A
  Top 1.016: TVS10.A 57.5,5.58 S02.2
  Bottom 1.422: SP10.2 57.5,5.58 S02.2
N$35  (via drill 0.3)
  Top 0.813: T11.4 T11.2 v63,27 | v60.5,16 60.5,11.5 62,10 62,9 TVS11.A
  Top 1.016: TVS11.A 62.5,5.66 S02.3
  Bottom 0.813: v60.5,16 60.5,24.5 v63,27
  Bottom 1.422: SP11.2 62.5,5.66 S02.3
N$36
  Top 0.813: T12.4 T12.2 63,17.95 65.05,15.9 65.05,11.55 67.3,9.3 TVS12.A
  Top 1.016: TVS12.A 67.5,5.74 S02.4
  Bottom 1.422: SP12.2 67.5,5.74 S02.4
N$37  (via drill 0.3)
  Top 0.813: T13.4 T13.2 72,27.6 v71.5,27.1 | v70.8,16.9 70.8,15.6 70.4,15.2 70.4,11.2 72.3,9.3 TVS13.A
  Top 1.016: TVS13.A 72.5,5.82 S02.5
  Bottom 0.813: v70.8,16.9 70.8,26.4 v71.5,27.1
  Bottom 1.422: SP13.2 72.5,5.82 S02.5
N$38
  Top 0.813: T14.4 T14.2 72,17.95 74.95,15 74.95,11.65 77.3,9.3 TVS14.A
  Top 1.016: TVS14.A 77.5,5.9 S02.6
  Bottom 1.422: SP14.2 77.5,5.9 S02.6
N$39  (via drill 0.3)
  Top 0.813: T15.4 T15.2 81,27.6 v80.5,27.1 | v79.5,15 80.4,14.1 80.4,11.2 82.3,9.3 TVS15.A
  Top 1.016: TVS15.A 82.5,5.98 S02.7
  Bottom 0.813: v79.5,15 79.5,26.1 v80.5,27.1
  Bottom 1.422: SP15.2 82.5,5.98 S02.7
N$40
  Top 0.813: T16.4 T16.2 81,18.35 81.05,18.3 81.2,18.3 85.55,13.95 85.55,11.05 87.3,9.3 TVS16.A
  Top 1.016: TVS16.A 87.5,6.06 S02.8
  Bottom 1.422: SP16.2 87.5,6.06 S02.8
N$41  (via drill 0.3)
  Top 0.203: Q9.3 v61.1,43.8
  Top 0.254: v58.5,34.7 58.5,33.5 58.4,33.4 58.5,33.3 RT9.2
  Bottom 0.203: v61.1,43.8 60.1,42.8 60.1,36 58.8,34.7 v58.5,34.7
N$42  (via drill 0.3)
  Top 0.203: Q10.3 v61.1,38.8
  Top 0.254: v58.5,24.7 58.5,23.5 58.4,23.4 58.5,23.3 RT10.2
  Bottom 0.203: v58.5,24.7 58.5,33.8 60.5,35.8 60.5,38.2 v61.1,38.8
N$43  (via drill 0.3)
  Top 0.254: v67.4,34.6 67.4,33.4 67.5,33.3 RT11.2
  Top 0.305: Q11.3 v69.1,44
  Bottom 0.203: v69.1,44 68.5,43.4 68.5,36.3 67.4,35.2 v67.4,34.6
N$44  (via drill 0.3)
  Top 0.254: v67.5,24.7 67.5,23.5 67.4,23.4 67.5,23.3 RT12.2
  Top 0.305: v69.2,38.9 69.2,40 Q12.3
  Bottom 0.203: v67.5,24.7 67.5,33.8 68.9,35.2 68.9,38.6 v69.2,38.9
N$45  (via drill 0.3)
  Top 0.254: v76.4,34.8 76.4,33.4 76.5,33.3 RT13.2
  Top 0.305: v77,43.9 77,45 Q13.3
  Bottom 0.203: v76.4,34.8 76.4,43.3 v77,43.9
N$46  (via drill 0.3)
  Top 0.254: v76.5,24.7 76.5,23.5 76.4,23.4 76.5,23.3 RT14.2
  Top 0.305: Q14.3 v77.1,39
  Bottom 0.203: v76.5,24.7 76.5,34 77.1,34.6 v77.1,39
N$47
  Top 0.254: RT15.2 85.5,38.1 86.4,39 86.4,44.5 85.9,45 Q15.3
N$48
  Top 0.203: Q16.3 85.1,38.7 83.8,37.4 83.8,32.4 82.1,30.7 82.1,27.8 83.7,26.2 83.7,25.15 RT16.2
N$49
  Top 0.254: 57,46 55.5,46 RQ9.1 | 57,46 58.5,46 Q9.1 | 57,46 RU9.2
N$50  (via drill 0.3)
  Top 0.813: T1.4 T1.2 18,27.6 v17.5,27.1 | v16.8,16.9 16.8,16.6 14.6,14.4 14.6,11.2 12.7,9.3 TVS1.A
  Top 1.016: TVS1.A 12.5,6 S01.1
  Bottom 0.813: v16.8,16.9 16.8,26.4 v17.5,27.1
  Bottom 1.422: SP1.2 12.5,6 S01.1
N$51
  Top 0.813: T2.4 T2.2 18,17.6 19.6,16 19.6,11.2 17.7,9.3 TVS2.A
  Top 1.016: TVS2.A 17.5,5.92 S01.2
  Bottom 1.422: SP2.2 17.5,5.92 S01.2
N$52  (via drill 0.3)
  Top 0.813: T3.4 T3.2 27,27.6 v26.5,27.1 | v25.8,16.9 25.8,15.6 24.6,14.4 24.6,11.2 22.7,9.3 TVS3.A
  Top 1.016: TVS3.A 22.5,5.84 S01.3
  Bottom 0.813: v25.8,16.9 25.8,26.4 v26.5,27.1
  Bottom 1.422: SP3.2 22.5,5.84 S01.3
N$53
  Top 0.813: T4.4 T4.2 27,17.7 29.6,15.1 29.6,11.2 27.7,9.3 TVS4.A
  Top 1.016: TVS4.A 27.5,5.76 S01.4
  Bottom 1.422: SP4.2 27.5,5.76 S01.4
N$54  (via drill 0.3)
  Top 0.813: T5.4 T5.2 36,27.6 v35.5,27.1 | v34.9,16.9 34.9,11.5 32.7,9.3 TVS5.A
  Top 1.016: TVS5.A 32.5,5.68 S01.5
  Bottom 0.813: v34.9,16.9 34.9,26.5 v35.5,27.1
  Bottom 1.422: SP5.2 32.5,5.68 S01.5
N$55
  Top 0.813: T6.4 T6.2 36.05,18.5 39.45,15.1 39.45,11.05 37.7,9.3 TVS6.A
  Top 1.016: TVS6.A 37.5,5.6 S01.6
  Bottom 1.422: SP6.2 37.5,5.6 S01.6
N$56  (via drill 0.3)
  Top 0.813: T7.4 T7.2 45,27.6 v44.5,27.1 | v43.9,16.9 43.9,15.9 44.6,15.2 44.6,11.2 42.7,9.3 TVS7.A
  Top 1.016: TVS7.A 42.5,5.52 S01.7
  Bottom 0.813: v43.9,16.9 43.9,26.5 v44.5,27.1
  Bottom 1.422: SP7.2 42.5,5.52 S01.7
N$57
  Top 0.813: T8.4 T8.2 45.1,18.5 47.05,16.55 47.95,16.55 49.45,15.05 49.45,11.05 47.7,9.3 TVS8.A
  Top 1.016: TVS8.A 47.5,5.44 S01.8
  Bottom 1.422: SP8.2 47.5,5.44 S01.8
N$58
  Top 0.254: 57,41 55.5,41 RQ10.1 | 57,41 58.5,41 Q10.1 | 57,41 RU10.2
N$59
  Top 0.254: 65,46 63.5,46 RQ11.1 | 65,46 66.5,46 Q11.1 | 65,46 RU11.2
N$60
  Top 0.254: 65,41 63.5,41 RQ12.1 | 65,41 66.5,41 Q12.1 | 65,41 RU12.2
N$61
  Top 0.254: 73,46 71.5,46 RQ13.1 | 73,46 74.5,46 Q13.1 | 73,46 RU13.2
N$62
  Top 0.254: 73,41 71.5,41 RQ14.1 | 73,41 74.5,41 Q14.1 | 73,41 RU14.2
N$63
  Top 0.254: 81,46 79.5,46 RQ15.1 | 81,46 82.5,46 Q15.1 | 81,46 RU15.2
N$64
  Top 0.254: 81,41 82.5,41 Q16.1 | 81,41 79.5,41 RQ16.1 | 81,41 RU16.2

### Text on the board
tNames: OpenSprinkler 16-Zone AC Expander | www.opensprinkler.com | CONFIG | 1 | 2 | 3 | 4 | GND +5V / SCL SDA / ACG ACG / - - / - - | - - / - - / ACG ACG / SDA SCL / +5V GND